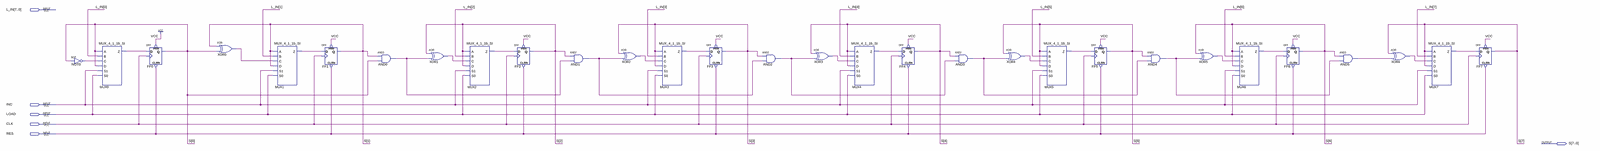
[diagram p0: schematic sheet, whole]
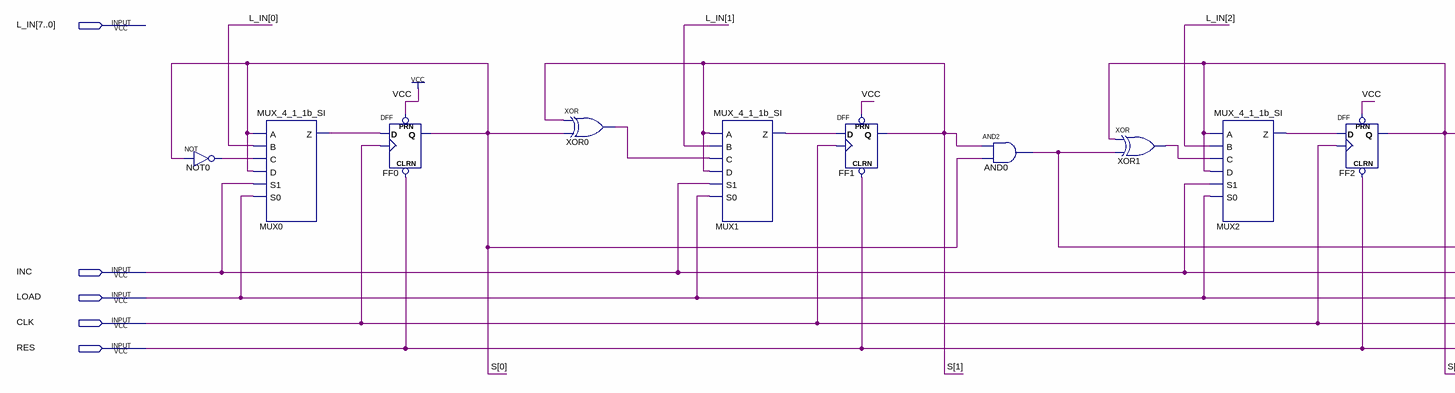
[diagram p1: schematic sheet, left part]
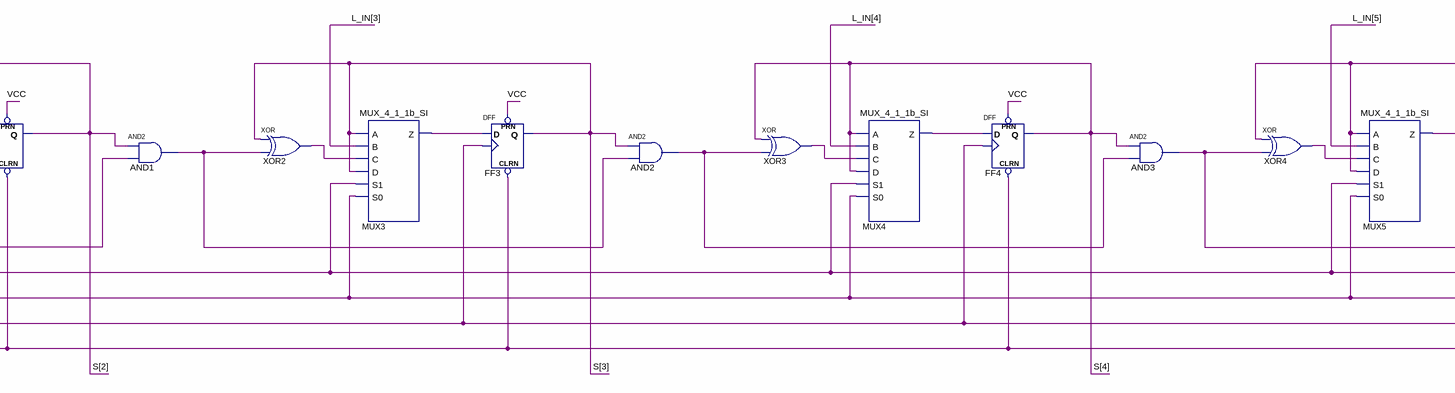
[diagram p2: schematic sheet, centre part]
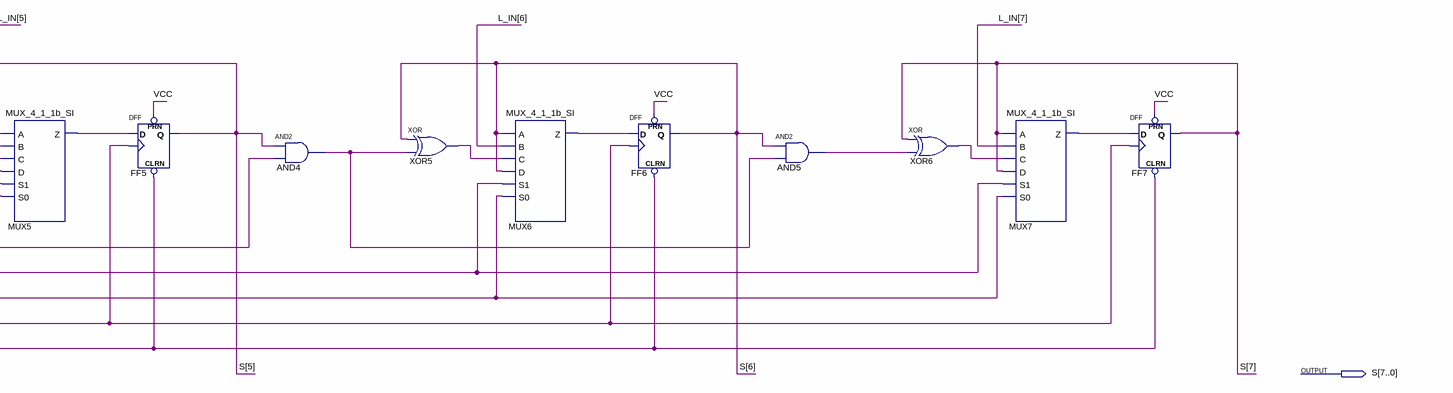
[diagram p3: schematic sheet, right part]
// Quartus schematic REG_INC_8b.bdf as structural Verilog: 30 symbols, 6 pins
module REG_INC_8b (
  input  [7:0] L_IN,
  input  INC,
  input  LOAD,
  input  CLK,
  input  RES,
  output [7:0] S
);

  wire AND0_out, AND1_out, AND2_out, AND3_out, AND4_out, AND5_out, MUX0_z, MUX1_z, MUX2_z, MUX3_z, MUX4_z,
       MUX5_z, MUX6_z, MUX7_z, NOT0_out, XOR0_out, XOR1_out, XOR2_out, XOR3_out, XOR4_out, XOR5_out, XOR6_out;

  not NOT0 (NOT0_out, S[0]);
  MUX_4_1_1b_SI MUX0 (.A(S[0]), .B(L_IN[0]), .C(NOT0_out), .D(S[0]), .S1(INC), .S0(LOAD), .Z(MUX0_z));
  DFF FF0 (.CLRN(RES), .CLK(CLK), .D(MUX0_z), .PRN(1'b1), .Q(S[0]));
  xor XOR0 (XOR0_out, S[1], S[0]);
  MUX_4_1_1b_SI MUX1 (.A(S[1]), .B(L_IN[1]), .C(XOR0_out), .D(S[1]), .S1(INC), .S0(LOAD), .Z(MUX1_z));
  DFF FF1 (.CLRN(RES), .CLK(CLK), .D(MUX1_z), .PRN(1'b1), .Q(S[1]));
  and AND0 (AND0_out, S[1], S[0]);
  xor XOR1 (XOR1_out, S[2], AND0_out);
  MUX_4_1_1b_SI MUX2 (.A(S[2]), .B(L_IN[2]), .C(XOR1_out), .D(S[2]), .S1(INC), .S0(LOAD), .Z(MUX2_z));
  DFF FF2 (.CLRN(RES), .CLK(CLK), .D(MUX2_z), .PRN(1'b1), .Q(S[2]));
  and AND1 (AND1_out, S[2], AND0_out);
  xor XOR2 (XOR2_out, S[3], AND1_out);
  MUX_4_1_1b_SI MUX3 (.A(S[3]), .B(L_IN[3]), .C(XOR2_out), .D(S[3]), .S1(INC), .S0(LOAD), .Z(MUX3_z));
  DFF FF3 (.CLRN(RES), .CLK(CLK), .D(MUX3_z), .PRN(1'b1), .Q(S[3]));
  and AND2 (AND2_out, S[3], AND1_out);
  xor XOR3 (XOR3_out, S[4], AND2_out);
  MUX_4_1_1b_SI MUX4 (.A(S[4]), .B(L_IN[4]), .C(XOR3_out), .D(S[4]), .S1(INC), .S0(LOAD), .Z(MUX4_z));
  DFF FF4 (.CLRN(RES), .CLK(CLK), .D(MUX4_z), .PRN(1'b1), .Q(S[4]));
  and AND3 (AND3_out, S[4], AND2_out);
  xor XOR4 (XOR4_out, S[5], AND3_out);
  MUX_4_1_1b_SI MUX5 (.A(S[5]), .B(L_IN[5]), .C(XOR4_out), .D(S[5]), .S1(INC), .S0(LOAD), .Z(MUX5_z));
  DFF FF5 (.CLRN(RES), .CLK(CLK), .D(MUX5_z), .PRN(1'b1), .Q(S[5]));
  and AND4 (AND4_out, S[5], AND3_out);
  xor XOR5 (XOR5_out, S[6], AND4_out);
  MUX_4_1_1b_SI MUX6 (.A(S[6]), .B(L_IN[6]), .C(XOR5_out), .D(S[6]), .S1(INC), .S0(LOAD), .Z(MUX6_z));
  DFF FF6 (.CLRN(RES), .CLK(CLK), .D(MUX6_z), .PRN(1'b1), .Q(S[6]));
  and AND5 (AND5_out, S[6], AND4_out);
  xor XOR6 (XOR6_out, S[7], AND5_out);
  MUX_4_1_1b_SI MUX7 (.A(S[7]), .B(L_IN[7]), .C(XOR6_out), .D(S[7]), .S1(INC), .S0(LOAD), .Z(MUX7_z));
  DFF FF7 (.CLRN(RES), .CLK(CLK), .D(MUX7_z), .PRN(1'b1), .Q(S[7]));
endmodule
